# EAGLE design KRP_SMproject_02 (EAGLE 9.4.2)
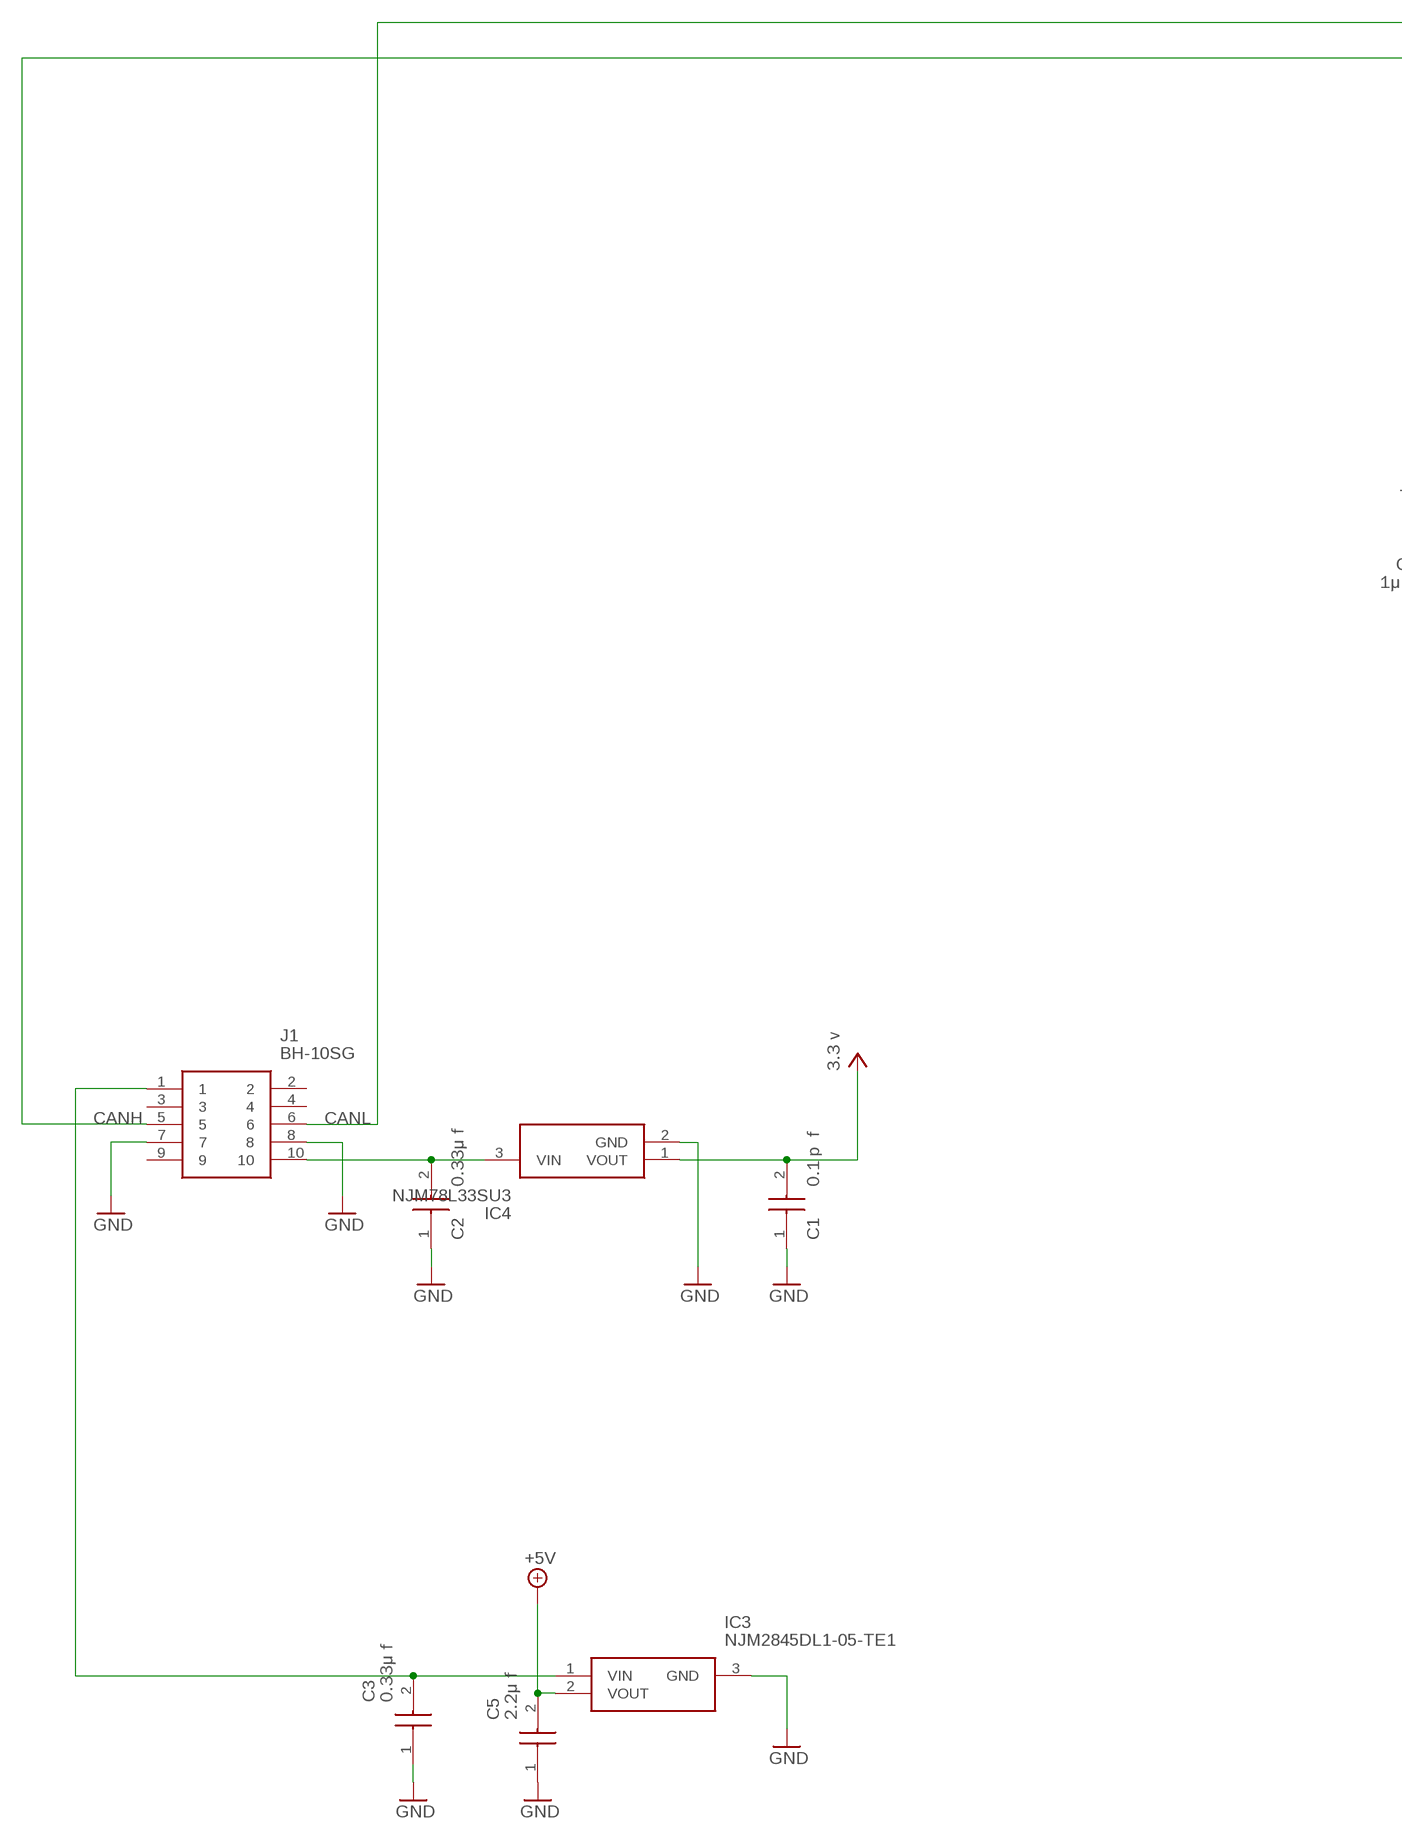
[diagram p0: schematic, sheet 1, part 1 of 2]
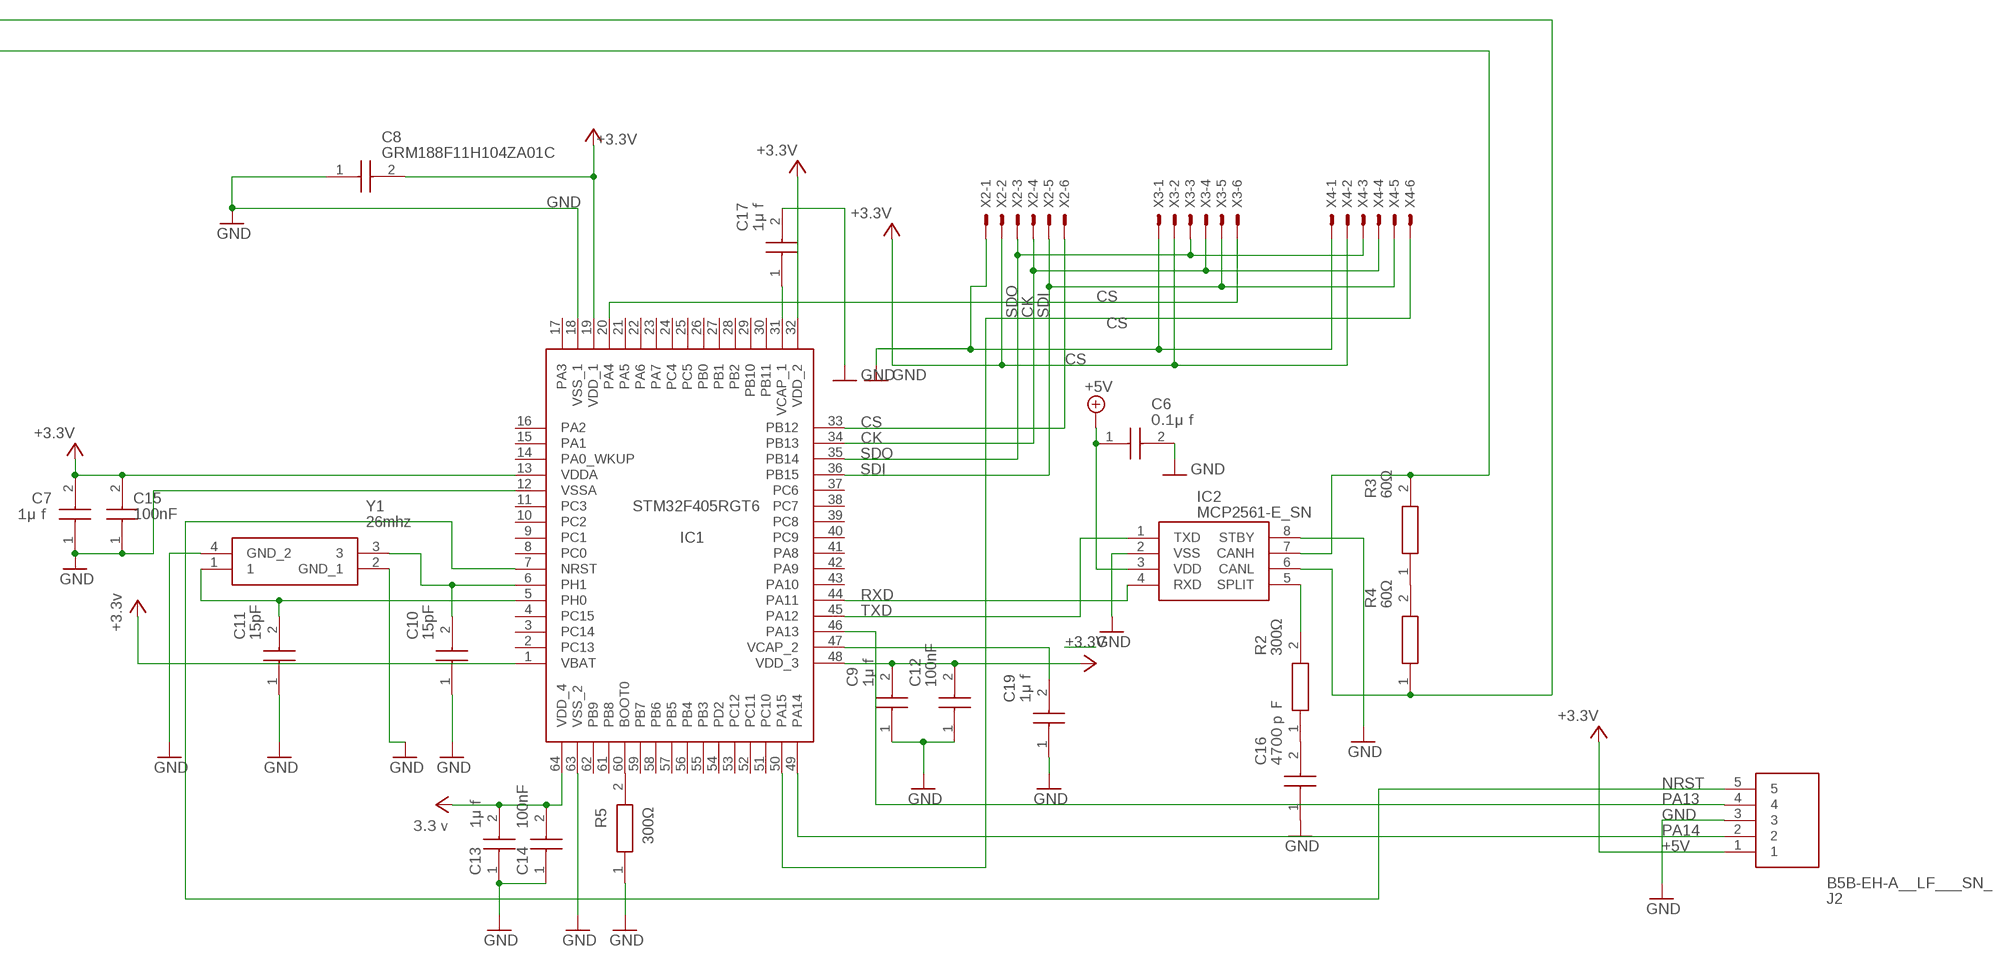
[diagram p1: schematic, sheet 1, part 2 of 2]

## Parts
C1  0.1ｐｆ  GRM188F11H104ZA01C  [CAPC1608X90N]
C2  0.33μｆ  GRM188F11H104ZA01C  [CAPC1608X90N]
C3  0.33μｆ  GRM188F11H104ZA01C  [CAPC1608X90N]
C5  2.2μｆ  GRM188F11H104ZA01C  [CAPC1608X90N]
C6  0.1μｆ  GRM188F11H104ZA01C  [CAPC1608X90N]
C7  1μｆ  GRM188F11H104ZA01C  [CAPC1608X90N]
C8  GRM188F11H104ZA01C  [CAPC1608X90N]
C9  1μｆ  GRM188F11H104ZA01C  [CAPC1608X90N]
C10  15pF  GRM188F11H104ZA01C  [CAPC1608X90N]
C11  15pF  GRM188F11H104ZA01C  [CAPC1608X90N]
C12  100nF  GRM188F11H104ZA01C  [CAPC1608X90N]
C13  1μｆ  GRM188F11H104ZA01C  [CAPC1608X90N]
C14  100nF  GRM188F11H104ZA01C  [CAPC1608X90N]
C15  100nF  GRM188F11H104ZA01C  [CAPC1608X90N]
C16  4700ｐＦ  GRM188F11H104ZA01C  [CAPC1608X90N]
C17  1μｆ  GRM188F11H104ZA01C  [CAPC1608X90N]
C19  1μｆ  GRM188F11H104ZA01C  [CAPC1608X90N]
IC1  STM32F405RGT6  [QFP50P1200X1200X160-64N]
IC2  MCP2561-E_SN  [SOIC127P600X175-8N]
IC3  NJM2845DL1-05-TE1  [TO-252-3-L1]
IC4  NJM78L33SU3  [SOT-89-3]
J1  BH-10SG  [SHDR10W64P254_2X5_2032X910X935]
J2  B5B-EH-A__LF___SN_  [SHDR5W64P0X250_1X5_1500X380X60]
R2  300Ω  RG1608N-101-W-T1  [RESC1608X50N]
R3  60Ω  RG1608N-101-W-T1  [RESC1608X50N]
R4  60Ω  RG1608N-101-W-T1  [RESC1608X50N]
R5  300Ω  RG1608N-101-W-T1  [RESC1608X50N]
X2  22-23-2061  [22-23-2061]
X3  22-23-2061  [22-23-2061]
X4  22-23-2061  [22-23-2061]
Y1  26mhz  FA-128_32.0000MF20X-K3  [FA128]

## Nets
+5V: C1.2 C5.2 C6.1 C7.2 C8.2 C9.2 C12.2 C13.2 C14.2 C15.2 IC1.1(VBAT) IC1.13(VDDA) IC1.19(VDD_1) IC1.32(VDD_2) IC1.48(VDD_3) IC1.64(VDD_4) IC2.3(VDD) IC3.2(VOUT) IC4.1(VOUT) J2.1 X2.2 X3.2 X4.2 ; supply symbol labelled +3.3V, 3.3ｖ, +3.3v
CANH: IC2.7(CANH) J1.5 R3.2
CANL: IC2.6(CANL) J1.6 R4.1
CK: IC1.34(PB13) X2.4 X3.4 X4.4
CS: IC1.20(PA4) IC1.33(PB12) IC1.50(PA15) X2.6 X3.6 X4.6
GND: C1.1 C2.1 C3.1 C5.1 C6.2 C7.1 C8.1 C9.1 C10.1 C11.1 C12.1 C13.1 C14.1 C15.1 C16.1 C17.2 C19.1 IC1.12(VSSA) IC1.18(VSS_1) IC1.63(VSS_2) IC2.2(VSS) IC2.8(STBY) IC3.3(GND) IC4.2(GND) J1.7 J1.8 J2.3 R5.1 X2.1 X3.1 X4.1 Y1.2(GND_1) Y1.4(GND_2)
N$1: C2.2 IC4.3(VIN) J1.10
N$3: C3.2 IC3.1(VIN) J1.1
N$5: IC2.5(SPLIT) R2.2
N$6: C16.2 R2.1
N$7: C11.2 IC1.5(PH0) Y1.1
N$8: C10.2 IC1.6(PH1) Y1.3
N$9: IC1.60(BOOT0) R5.2
N$10: C17.1 IC1.31(VCAP_1)
N$11: C19.2 IC1.47(VCAP_2)
N$13: R3.1 R4.2
NRST: IC1.7(NRST) J2.5
PA13: IC1.46(PA13) J2.4
PA14: IC1.49(PA14) J2.2
RXD: IC1.44(PA11) IC2.4(RXD)
SDI: IC1.36(PB15) X2.5 X3.5 X4.5
SDO: IC1.35(PB14) X2.3 X3.3 X4.3
TXD: IC1.45(PA12) IC2.1(TXD)
Unconnected: IC1.2(PC13) IC1.3(PC14) IC1.4(PC15) IC1.8(PC0) IC1.9(PC1) IC1.10(PC2) IC1.11(PC3) IC1.14(PA0_WKUP) IC1.15(PA1) IC1.16(PA2) IC1.17(PA3) IC1.21(PA5) IC1.22(PA6) IC1.23(PA7) IC1.24(PC4) IC1.25(PC5) IC1.26(PB0) IC1.27(PB1) IC1.28(PB2) IC1.29(PB10) IC1.30(PB11) IC1.37(PC6) IC1.38(PC7) IC1.39(PC8) IC1.40(PC9) IC1.41(PA8) IC1.42(PA9) IC1.43(PA10) IC1.51(PC10) IC1.52(PC11) IC1.53(PC12) IC1.54(PD2) IC1.55(PB3) IC1.56(PB4) IC1.57(PB5) IC1.58(PB6) IC1.59(PB7) IC1.61(PB8) IC1.62(PB9) J1.2 J1.3 J1.4 J1.9

## Library data of the parts
C1-C3 C5-C17 C19 = GRM188F11H104ZA01C:GRM188F11H104ZA01C: Multilayer Ceramic Capacitors MLCC - SMD/SMT Source: Datasheet <http://componentsearchengine.com/Datasheets/1/GRM188F11H104ZA01C.pdf>; DESCRIPTION: Multilayer Ceramic Capacitors MLCC - SMD/SMT; HEIGHT: 0.9mm; MANUFACTURER_NAME: Murata Electronics; MANUFACTURER_PART_NUMBER: GRM188F11H104ZA01C
IC1 = STM32F405RGT6:STM32F405RGT6: MCU 32-Bit, ARM Cortex M4, 1MB Flash STMicroelectronics STM32F405RGT6, 32bit ARM Cortex M4F Microcontroller, 168MHz, 1024 kB Flash, 64-Pin LQFP Source: Datasheet <http://uk.rs-online.com/web/p/products/7468217P>; ALLIED_NUMBER: 70391099; DESCRIPTION: MCU 32-Bit, ARM Cortex M4, 1MB Flash STMicroelectronics STM32F405RGT6, 32bit ARM Cortex M4F Microcontroller, 168MHz, 1024 kB Flash, 64-Pin LQFP; HEIGHT: 1.6mm; MANUFACTURER_NAME: STMicroelectronics; MANUFACTURER_PART_NUMBER: STM32F405RGT6; RS_PART_NUMBER: 7468217P; RS_PRICE-STOCK: http://uk.rs-online.com/web/p/products/7468217P
IC2 = MCP2561-E_SN:MCP2561-E_SN: CAN Transceiver 1Mbps 5V 125degC SOIC8 Microchip MCP2561-E/SN, CAN Transceiver 1MBps 1-channel IEC 61000-4-2, 8-Pin SOIC Source: Datasheet <http://uk.rs-online.com/web/p/products/7990216P>; ALLIED_NUMBER: 70415103; DESCRIPTION: CAN Transceiver 1Mbps 5V 125degC SOIC8 Microchip MCP2561-E/SN, CAN Transceiver 1MBps 1-channel IEC 61000-4-2, 8-Pin SOIC; HEIGHT: 1.75mm; MANUFACTURER_NAME: Microchip; MANUFACTURER_PART_NUMBER: MCP2561-E/SN; RS_PART_NUMBER: 7990216P; RS_PRICE-STOCK: http://uk.rs-online.com/web/p/products/7990216P
IC3 = NJM2845DL1-05-TE1:NJM2845DL1-05-TE1: LDO Voltage Regulators LDO w/On/Off Cntrl Source: Datasheet <http://www.njr.com/semicon/PDF/NJM2845_NJM2846_E.pdf>; DESCRIPTION: LDO Voltage Regulators LDO w/On/Off Cntrl; HEIGHT: mm; MANUFACTURER_NAME: NJR; MANUFACTURER_PART_NUMBER: NJM2845DL1-05-TE1
IC4 = NJM78L33SU3:NJM78L33SU3: 3-TERMINAL POSITIVE VOLTAGE REGULATOR Source: Datasheet <http://www.datasheet4u.com/datasheet-pdf/NewJapanRadio/NJM78L33SU3/pdf.php?id=1157057>; DESCRIPTION: 3-TERMINAL POSITIVE VOLTAGE REGULATOR; HEIGHT: mm; MANUFACTURER_NAME: JRC; MANUFACTURER_PART_NUMBER: NJM78L33SU3
J1 = BH-10SG:BH-10SG: ic Source: Datasheet <http://akizukidenshi.com/download/ds/useconn/BH-XXSG.pdf>; DESCRIPTION: ic; HEIGHT: 9.35mm; MANUFACTURER_NAME: Useconn Electronics; MANUFACTURER_PART_NUMBER: BH-10SG
J2 = B5B-EH-A__LF___SN_:B5B-EH-A__LF___SN_: 5 way 1 row top entry header,2.5mm pitch JST EH Series, 2.5mm Pitch 5 Way 1 Row Straight PCB Header, Solder Termination, 3A Source: Datasheet <http://uk.rs-online.com/web/p/products/5151412P>; DESCRIPTION: 5 way 1 row top entry header,2.5mm pitch JST EH Series, 2.5mm Pitch 5 Way 1 Row Straight PCB Header, Solder Termination, 3A; HEIGHT: 6mm; MANUFACTURER_NAME: JST (JAPAN SOLDERLESS TERMINALS); MANUFACTURER_PART_NUMBER: B5B-EH-A (LF) (SN); RS_PART_NUMBER: 5151412P; RS_PRICE-STOCK: http://uk.rs-online.com/web/p/products/5151412P
R2-R5 = RG1608N-101-W-T1:RG1608N-101-W-T1: Thin Film Resistors - SMD 1/10W 100 Ohms 0.05% 0603 10ppm Source: Datasheet <http://uk.rs-online.com/web/p/products/0160452>; DESCRIPTION: Thin Film Resistors - SMD 1/10W 100 Ohms 0.05% 0603 10ppm; HEIGHT: 0.5mm; MANUFACTURER_NAME: Susumu; MANUFACTURER_PART_NUMBER: RG1608N-101-W-T1; RS_PART_NUMBER: 0160452; RS_PRICE-STOCK: http://uk.rs-online.com/web/p/products/0160452
X2-X4 = con-molex:22-23-2061: .100" (2.54mm) Center Header - 6 Pin; MF: MOLEX; MPN: 22-23-2061; OC_FARNELL: 1462922; OC_NEWARK: 27C1933
Y1 = FA-128_32.0000MF20X-K3:FA-128_32.0000MF20X-K3: MHz range crystal unit, FA-128 Source: Datasheet <https://support.epson.biz/td/api/doc_check.php?dl=brief_FA-128&lang=en>; DESCRIPTION: MHz range crystal unit, FA-128; HEIGHT: mm; MANUFACTURER_NAME: Epson Timing; MANUFACTURER_PART_NUMBER: FA-128 32.0000MF20X-K3

## Board
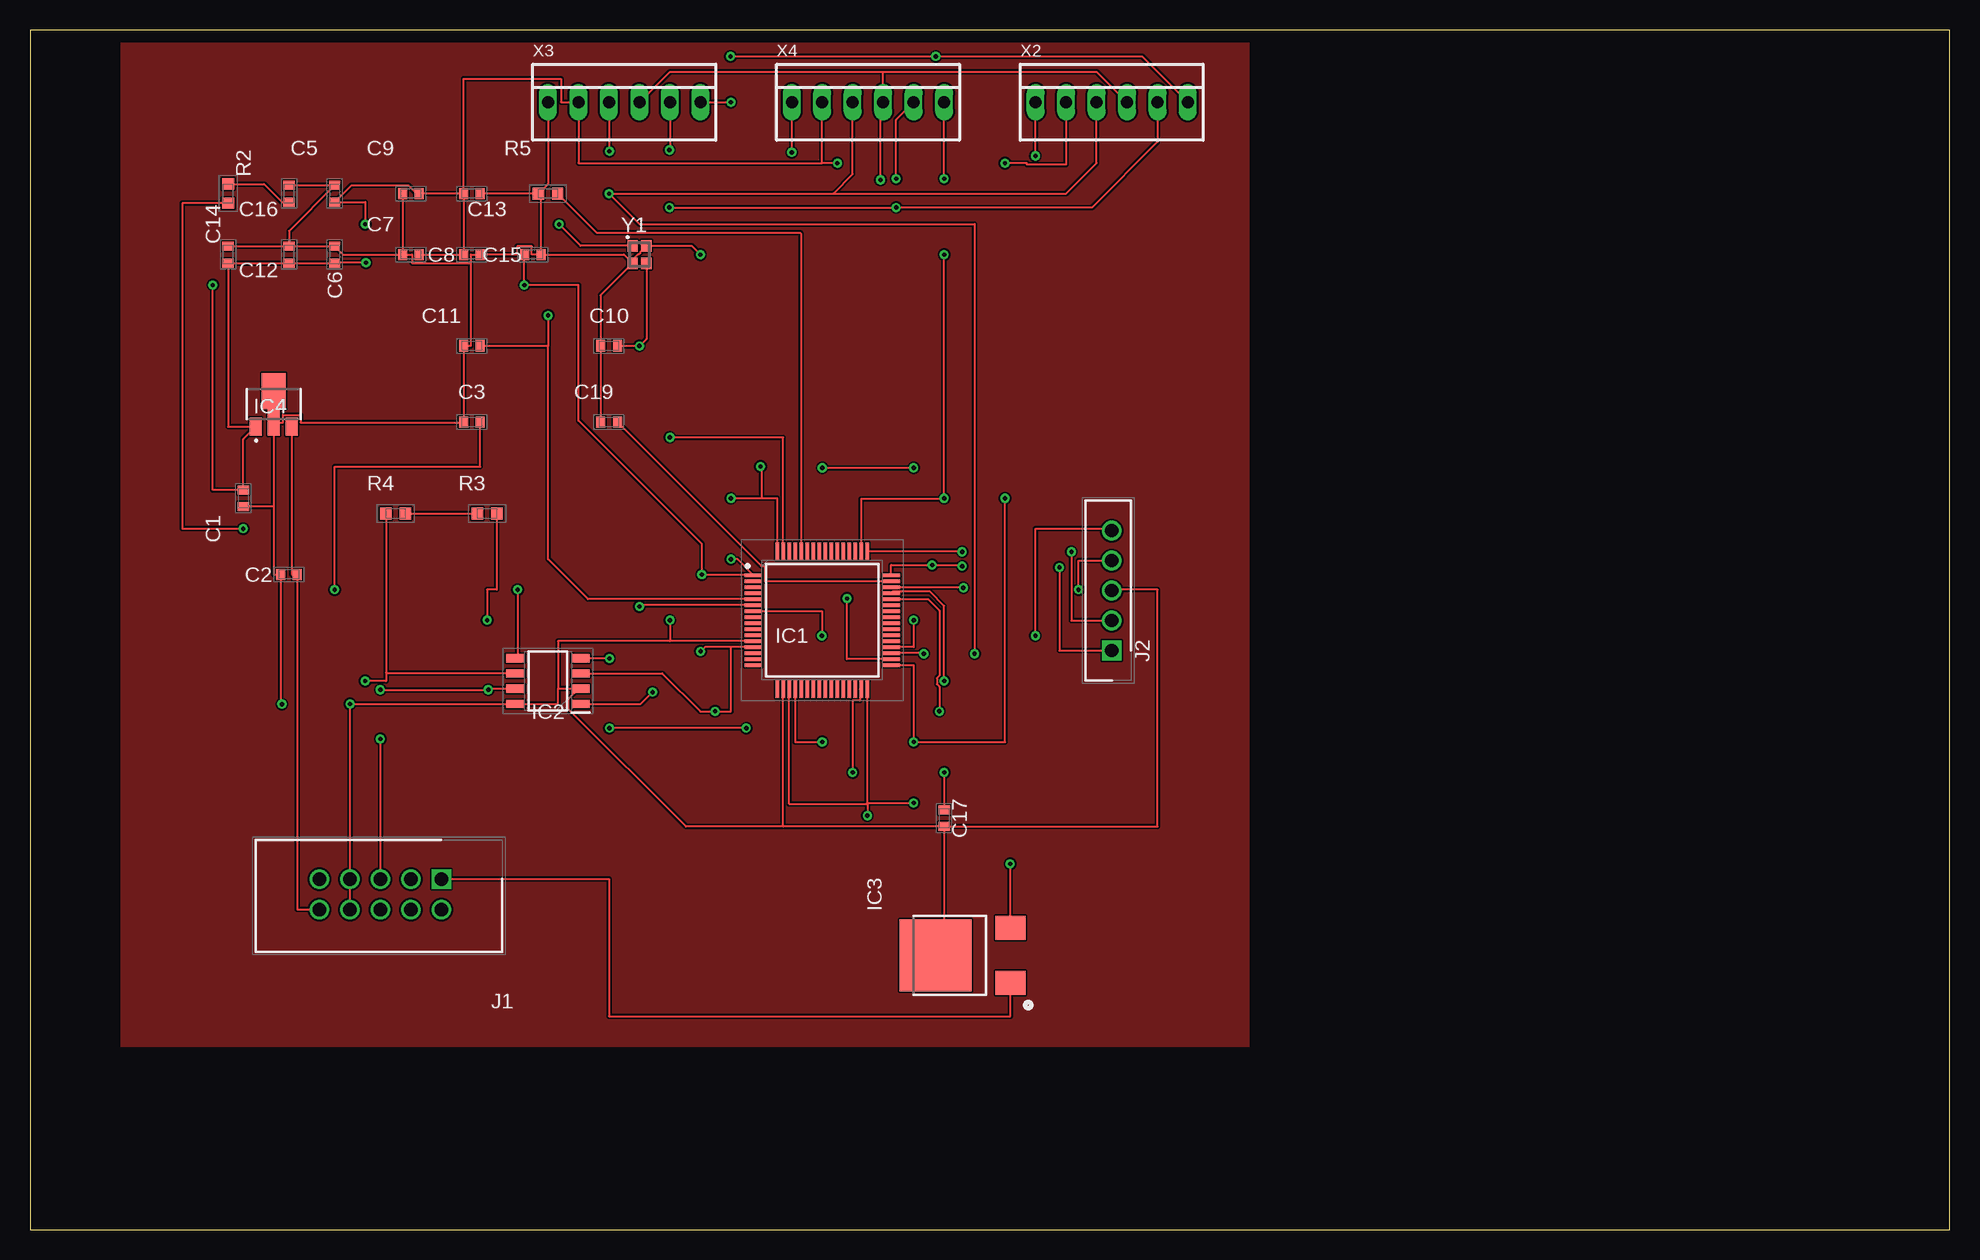
[diagram p2: board, top side]
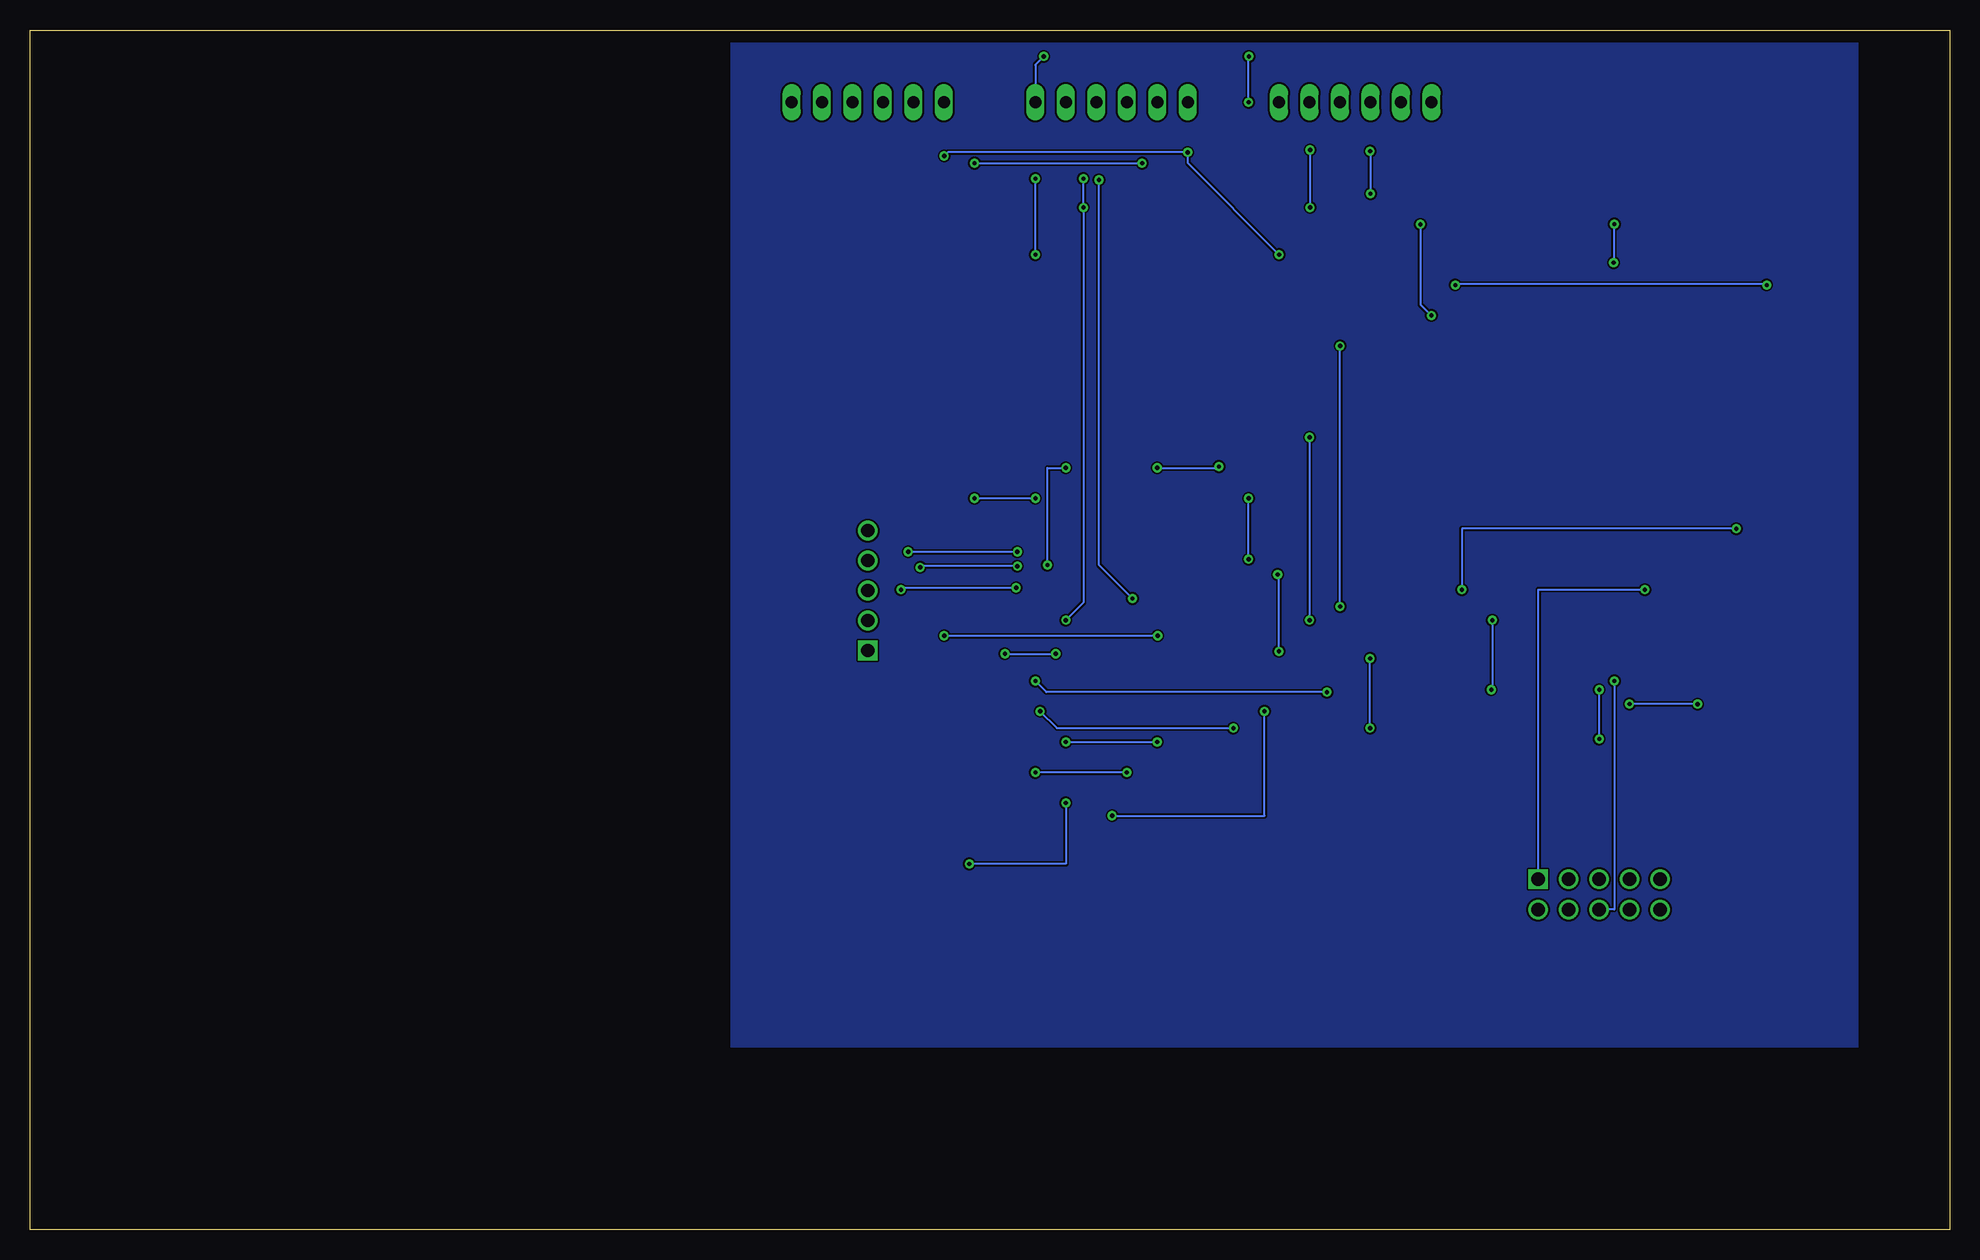
[diagram p3: board, bottom side, seen from below]

Size 160 x 100 mm. Coordinates in mm from the lower left corner, seen from the top.
Outline: 0,0 160,0 160,100 0,100 0,0
Copper layers (1*16): Top 0.035mm / dielectric 1.5mm / Bottom 0.035mm
Design rules "default": minimum track width 6mil, minimum drill 0.35mm, track to track 6mil, track to pad 6mil, pad to pad 6mil, via to via 6mil, smd to smd 6mil, copper to edge 40mil, drill to drill 6mil, minimum pad ring 10mil, minimum via ring 8mil, stop-mask expansion 4mil, vias tented up to drill 0mil, thermal gap 10mil

### Footprints (pad centres in the part's own frame; a part is rotated, then mirrored left to right if it is on the bottom)
CAPC1608X90N = smd 0.75 x 0.94: 1 -0.7,0; 2 0.7,0
QFP50P1200X1200X160-64N = smd 1.45 x 0.3: 1 -5.75,3.75; 2 -5.75,3.25; 3 -5.75,2.75; 4 -5.75,2.25; 5 -5.75,1.75; 6 -5.75,1.25; 7 -5.75,0.75; 8 -5.75,0.25; 9 -5.75,-0.25; 10 -5.75,-0.75; 11 -5.75,-1.25; 12 -5.75,-1.75; 13 -5.75,-2.25; 14 -5.75,-2.75; 15 -5.75,-3.25; 16 -5.75,-3.75; 33 5.75,-3.75; 34 5.75,-3.25; 35 5.75,-2.75; 36 5.75,-2.25; 37 5.75,-1.75; 38 5.75,-1.25; 39 5.75,-0.75; 40 5.75,-0.25; 41 5.75,0.25; 42 5.75,0.75; 43 5.75,1.25; 44 5.75,1.75; 45 5.75,2.25; 46 5.75,2.75; 47 5.75,3.25; 48 5.75,3.75 | smd 0.3 x 1.45: 17 -3.75,-5.75; 18 -3.25,-5.75; 19 -2.75,-5.75; 20 -2.25,-5.75; 21 -1.75,-5.75; 22 -1.25,-5.75; 23 -0.75,-5.75; 24 -0.25,-5.75; 25 0.25,-5.75; 26 0.75,-5.75; 27 1.25,-5.75; 28 1.75,-5.75; 29 2.25,-5.75; 30 2.75,-5.75; 31 3.25,-5.75; 32 3.75,-5.75; 49 3.75,5.75; 50 3.25,5.75; 51 2.75,5.75; 52 2.25,5.75; 53 1.75,5.75; 54 1.25,5.75; 55 0.75,5.75; 56 0.25,5.75; 57 -0.25,5.75; 58 -0.75,5.75; 59 -1.25,5.75; 60 -1.75,5.75; 61 -2.25,5.75; 62 -2.75,5.75; 63 -3.25,5.75; 64 -3.75,5.75
SOIC127P600X175-8N = smd 1.525 x 0.7: 1 -2.712,1.905; 2 -2.712,0.635; 3 -2.712,-0.635; 4 -2.712,-1.905; 5 2.712,-1.905; 6 2.712,-0.635; 7 2.712,0.635; 8 2.712,1.905
TO-252-3-L1 = smd 2 x 2.5: 1 -2.3,-8.05; 2 2.3,-8.05 | smd 6 x 6: 3 0,-1.8
SOT-89-3 = smd 1 x 1.5: 1 -1.5,-1.65; 3 1.5,-1.65 | smd 1 x 2.2: 2 0,-1.3 | smd 2 x 3: 4 0,1.3
SHDR10W64P254_2X5_2032X910X935 = drill 1.1 pad 1.65 square: 1 0,0 | drill 1.1 pad 1.65: 2 0,2.54; 3 2.54,0; 4 2.54,2.54; 5 5.08,0; 6 5.08,2.54; 7 7.62,0; 8 7.62,2.54; 9 10.16,0; 10 10.16,2.54
SHDR5W64P0X250_1X5_1500X380X60 = drill 1.1 pad 1.65 square: 1 0,0 | drill 1.1 pad 1.65: 2 2.5,0; 3 5,0; 4 7.5,0; 5 10,0
RESC1608X50N = smd 0.95 x 1: 1 -0.8,0; 2 0.8,0
22-23-2061 = drill 1 long: 1 -6.35,0; 2 -3.81,0; 3 -1.27,0; 4 1.27,0; 5 3.81,0; 6 6.35,0
FA128 = smd 0.95 x 0.85: 1 -0.725,-0.575; 2 0.725,-0.575; 3 0.725,0.575; 4 -0.725,0.575

### Placement (x,y rotation side)
C1  17.78,60.96 90 top
C2  21.59,54.61 0 top
C3  36.83,67.31 0 top
C5  25.4,86.36 270 top
C6  25.4,81.28 90 top
C7  31.75,81.28 0 top
C8  36.83,81.28 180 top
C9  31.75,86.36 0 top
C10  48.26,73.66 0 top
C11  36.83,73.66 0 top
C12  21.59,81.28 270 top
C13  36.83,86.36 180 top
C14  16.51,81.28 270 top
C15  41.91,81.28 180 top
C16  21.59,86.36 270 top
C17  76.2,34.29 270 top
C19  48.26,67.31 0 top
IC1  66.04,50.8 0 top
IC2  43.18,45.72 180 top
IC3  73.66,22.86 90 top
IC4  20.32,68.58 0 top
J1  34.29,29.21 180 top
J2  90.17,48.26 90 top
R2  16.51,86.36 270 top
R3  38.1,59.69 0 top
R4  30.48,59.69 0 top
R5  43.18,86.36 0 top
X2  90.17,93.98 0 top
X3  49.53,93.98 0 top
X4  69.85,93.98 0 top
Y1  50.8,81.28 270 top

### Tracks (layer width: path | path; a pad name or v marks a point on that pad's centre or on a via)
+5V  (via drill 0.35)
  Top 0.152: C7.2 C8.2 C13.2 | C13.2 C9.2 32.22,86.36 31.52,87.06 26.8,87.06 C5.2 27.94,85.66 v27.94,83.82 | v28,80.6 25.42,80.6 C6.1 C12.2 C14.2 16.51,66.93 IC4.1 17.78,65.89 C1.2 15.24,61.66 v15.24,78.74 | C15.2 v41.2,78.74 45.72,78.74 45.72,67.42 56,57.14 v56,54.6 60.24,54.6 IC1.1 58.96,55.88 v58.42,55.88 | IC1.32 69.79,35.56 | 69.79,35.56 69.79,35.5 63.29,35.5 IC1.19 | 69.8,35.56 v73.66,35.56 | v81.7,30.48 IC3.2 | 69.79,35.56 69.8,35.56 | 69.8,35.56 v69.8,34.5 | IC1.13 58.42,48.55 | 58.42,48.55 58.42,43.2 v57.1,43.2 57.08,43.18 55.88,43.18 52.7,46.35 IC2.3 | C13.2 36.13,95.92 44.26,95.92 44.26,93.98 X3.2 45.72,88.9 66.04,88.9 | 66.04,88.9 X4.2 | 58.42,48.55 56.25,48.55 v55.9,48.2 | v81.28,88.9 83.09,88.9 83.09,88.79 86.36,88.79 X2.2 | v67.3,88.9 66.04,88.9 | v58.42,60.96 60.96,60.96 | 60.96,60.96 62.29,60.96 IC1.64 | IC1.48 71.79,55.4 v75.2,55.4 77.7,55.4 v77.7,55.3 | v73.66,63.5 v66.04,63.5 | v60.9,63.6 60.96,63.6 60.96,60.96 | v85.8,55.2 85.8,48.26 J2.1
  Bottom 0.152: v27.94,83.82 28,83.76 v28,80.6 | v15.24,78.74 15.24,78.8 41.2,78.8 v41.2,78.74 | v73.66,35.56 73.66,30.48 v81.7,30.48 | v69.8,34.5 57.1,34.5 v57.1,43.2 | v55.9,48.2 55.9,54.5 v56,54.6 | v81.28,88.9 v67.3,88.9 | v58.42,55.88 v58.42,60.96 | v75.2,55.4 75.2,63.5 v73.66,63.5 | v66.04,63.5 60.9,63.5 v60.9,63.6 | v77.7,55.3 85.8,55.3 v85.8,55.2
AAA
  pour Top: 7.62,99.06 101.6,99.06 101.6,15.24 7.62,15.24
BBB
  pour Bottom: 7.62,99.06 101.6,99.06 101.6,15.24 7.62,15.24
CANH  (via drill 0.35)
  Top 0.152: R3.2 38.9,53.34 38.1,53.34 v38.1,50.8 | IC2.7 38.2,45.09 v38.2,45 v29.2,45 | J1.5 v29.21,40.9 v29.2,40.9
  Bottom 0.152: v38.1,50.8 38.1,45 v38.2,45 | v29.2,40.9 v29.2,45
CANL  (via drill 0.35)
  Top 0.152: R4.1 29.68,46.4 | IC2.6 40.47,46.4 29.68,46.4 | 29.68,46.4 29.68,45.72 v27.94,45.72
  Bottom 0.152: v27.94,45.72 27.94,26.67 J1.6
CK  (via drill 0.35)
  Top 0.152: X3.4 53.34,96.52 71.12,96.52 | 71.12,96.52 X4.4 70.9,93.76 v70.9,87.5 | 71.12,96.52 88.9,96.52 X2.4 | IC1.34 68.1,47.55 v68.1,52.6
  Bottom 0.152: v68.1,52.6 70.9,55.4 v70.9,87.5
CS  (via drill 0.35)
  Top 0.152: IC1.33 73.66,47.05 v73.66,40.64 81.28,40.64 v81.28,60.96 | IC1.20 63.79,40.64 v66.04,40.64 | X3.6 v58.42,93.98 | v58.4,97.8 v75.5,97.8 92.7,97.8 X2.6 | IC1.50 69.29,60.89 69.3,60.9 76.14,60.9 v76.2,60.96 v76.2,81.28 | v76.2,87.6 X4.6
  Bottom 0.152: v73.66,40.64 v66.04,40.64 | v58.42,93.98 58.42,97.78 v58.4,97.8 | v75.5,97.8 76.2,97.1 X4.6 | v81.28,60.96 v76.2,60.96 | v76.2,81.28 v76.2,87.6
GND  (via drill 0.35)
  Top 0.152: C16.1 C5.1 21.59,83.25 C12.1 | C9.1 C7.1 | C7.1 26.1,81.28 C6.2 C12.1 | C14.1 C12.1 | 20.32,60.26 IC4.2 21.09,67.28 21.09,67.91 22.55,67.91 22.55,67.28 36.13,67.28 C3.1 C11.1 36.73,73.66 36.73,80.58 | 20.32,60.26 C1.1 | 20.32,60.26 20.32,54.61 C2.1 20.89,43.8 v21,43.8 | C7.1 31.85,81.28 31.85,80.58 36.73,80.58 | 36.73,80.58 36.73,81.28 C8.1 40.61,81.28 40.61,81.98 41.81,81.98 41.81,81.28 C15.1 | J1.8 J1.7 v26.67,43.81 IC2.8 44,43.81 44,45.09 | C17.2 76.2,22.86 IC3.3 | C17.2 62.79,33.59 | 62.79,33.59 IC1.18 | C17.2 93.98,33.59 93.98,53.34 90.17,53.34 J2.3 | IC1.12 53.34,49.05 | 53.34,49.05 44,49.05 44,45.09 | 44,45.09 45.72,45.09 | 45.72,45.09 IC2.2 | C15.1 42.61,86.36 R5.1 | R5.1 C13.1 | X3.1 43.18,87.16 R5.1 | C19.1 C10.1 47.56,77.89 Y1.2 | 45.72,45.09 45.72,45.08 44.9,44.26 44.9,43.37 54.68,33.59 62.79,33.59 | C15.1 49.5,81.28 Y1.2 | Y1.2 50.23,80.86 50.67,81.3 50.74,81.3 50.88,81.44 50.88,81.51 Y1.4 55.16,82 v55.88,81.28 | v63.5,89.8 X4.1 | v83.8,89.5 83.8,93.96 X2.1 | IC1.63 62.79,66.04 v53.34,66.04 | v53.34,50.8 53.34,49.05
  Bottom 0.152: v21,43.8 v26.67,43.8 v26.67,43.81 | v55.88,81.28 63.5,88.9 v63.5,89.8 83.5,89.8 v83.8,89.5 | v53.34,66.04 v53.34,50.8
N$1
  Top 0.152: IC4.3 21.82,54.61 C2.2 22.29,26.67 J1.10
N$3  (via drill 0.35)
  Top 0.152: J1.1 48.26,29.21 48.26,17.78 81.71,17.78 IC3.1 | v25.4,53.34 25.4,63.6 37.53,63.6 C3.2
  Bottom 0.152: J1.1 34.29,53.34 v25.4,53.34
N$5  (via drill 0.35)
  Top 0.152: R2.2 12.7,85.56 12.7,58.42 v17.78,58.42 | v40.64,53.34 40.64,47.62 IC2.5
  Bottom 0.152: v17.78,58.42 40.64,58.42 v40.64,53.34
N$6
  Top 0.152: R2.1 19.52,87.16 21.02,85.66 C16.2
N$7  (via drill 0.35)
  Top 0.152: IC1.5 46.51,52.55 43.18,55.88 43.18,73.66 | 43.18,73.66 C11.2 | Y1.1 45.9,82 v44.1,83.8 | v43.18,76.2 43.18,73.66
  Bottom 0.152: v44.1,83.8 44.1,77.12 v43.18,76.2
N$8  (via drill 0.35)
  Top 0.152: IC1.6 50.91,52.05 v50.8,51.94 | C10.2 v50.8,73.66 51.38,74.23 Y1.3
  Bottom 0.152: v50.8,51.94 v50.8,73.66
N$9
  Top 0.152: R5.2 47.24,83.1 64.2,83.1 64.29,83.01 IC1.60
N$10  (via drill 0.35)
  Top 0.152: IC1.31 69.17,45.05 69.17,44.1 68.58,44.1 v68.58,38.1 | v76.2,38.1 C17.1
  Bottom 0.152: v68.58,38.1 v76.2,38.1
N$11
  Top 0.152: IC1.47 61.24,54.05 61.24,55.31 60.96,55.31 C19.2
N$13
  Top 0.152: R4.2 R3.1
NRST  (via drill 0.35)
  Top 0.152: IC1.7 66,51.55 v66,49.5 | v83.8,49.5 83.82,49.5 83.82,58.42 90.17,58.42 J2.5
  Bottom 0.152: v66,49.5 v83.8,49.5
PA13  (via drill 0.35)
  Top 0.152: IC1.46 77.8,53.55 v77.8,53.5 | v87.41,53.34 87.41,55.76 J2.4
  Bottom 0.152: v77.8,53.5 87.41,53.5 v87.41,53.34
PA14  (via drill 0.35)
  Top 0.152: IC1.49 77.65,56.55 v77.7,56.5 | v86.8,56.5 86.8,50.76 J2.2
  Bottom 0.152: v77.7,56.5 v86.8,56.5
RXD  (via drill 0.35)
  Top 0.152: IC1.44 74.85,52.55 75.8,51.6 75.8,46.18 75.59,45.97 75.59,45.47 75.8,45.26 v75.8,43.2 | v59.7,41.8 v48.3,41.8 | v48.3,47.6 48.27,47.62 IC2.4
  Bottom 0.152: v75.8,43.2 74.4,41.8 v59.7,41.8 | v48.3,41.8 v48.3,47.6
SDI  (via drill 0.35)
  Top 0.152: X3.5 53.34,90.04 v53.3,90 | v53.3,85.2 v72.2,85.2 88.5,85.2 93.98,90.68 X2.5 | v72.2,87.6 72.2,92.52 X4.5 | v73.66,50.8 73.66,48.55 IC1.36
  Bottom 0.152: v53.3,90 v53.3,85.2 | v72.2,87.6 v72.2,85.2 72.2,52.26 v73.66,50.8
SDO  (via drill 0.35)
  Top 0.152: X3.3 48.26,89.94 v48.3,89.9 | 66.96,86.36 v48.26,86.36 50.8,83.82 78.74,83.82 v78.74,48 | X4.3 68.58,87.98 66.96,86.36 | 66.96,86.36 86.36,86.36 88.9,88.9 X2.3 | v74.5,48 74.5,48.05 IC1.35
  Bottom 0.152: v48.3,89.9 48.26,89.86 v48.26,86.36 | v78.74,48 v74.5,48
TXD  (via drill 0.35)
  Top 0.152: IC2.1 50.91,43.81 v51.9,44.8 | v76.2,45.72 76.2,52 75,53.2 72.64,53.2 72.61,53.17 71.91,53.17 IC1.45
  Bottom 0.152: v51.9,44.8 75.28,44.8 v76.2,45.72